# Altium schematic sheet Module.SchDoc
size A4
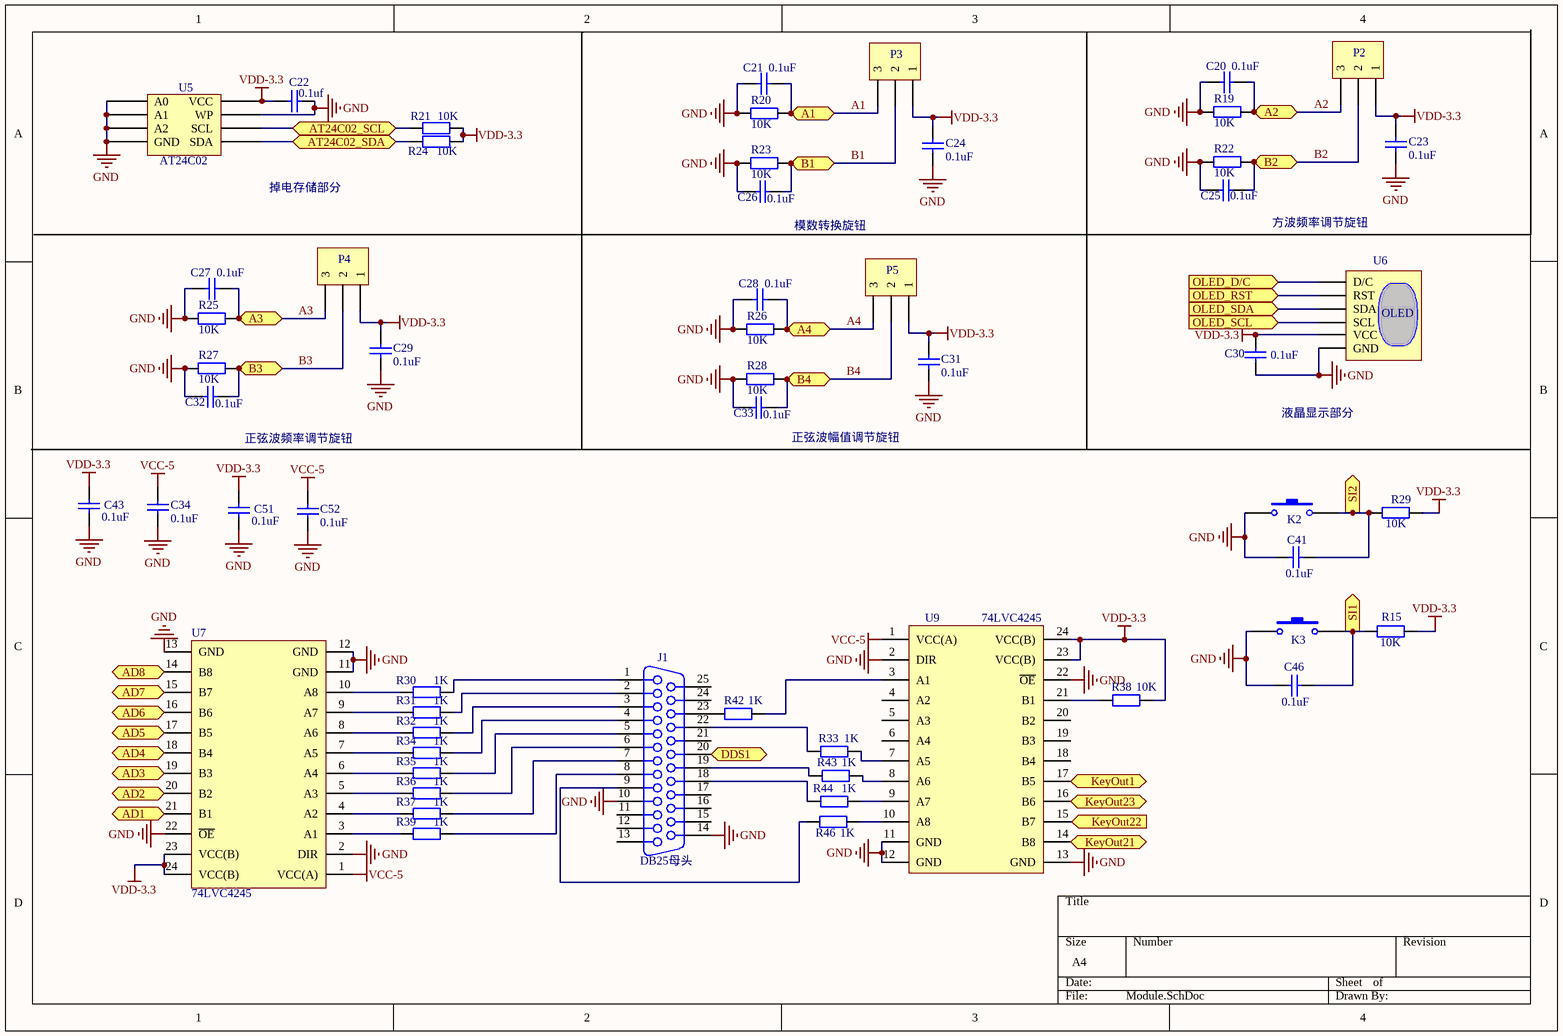
[diagram p0: Module.SchDoc]

## Parts
C20  value 0.1uF  [0603]  (hidden comment: Capacitor-0603)
C21  value 0.1uF  [0603]  (hidden comment: Capacitor-0603)
C22  value 0.1uf  [0603]  (hidden comment: Capacitor-0603)
C23  value 0.1uF  [0603]  (hidden comment: Capacitor-0603)
C24  value 0.1uF  [0603]  (hidden comment: Capacitor-0603)
C25  value 0.1uF  [0603]  (hidden comment: Capacitor-0603)
C26  value 0.1uF  [0603]  (hidden comment: Capacitor-0603)
C27  value 0.1uF  [0603]  (hidden comment: Capacitor-0603)
C28  value 0.1uF  [0603]  (hidden comment: Capacitor-0603)
C29  value 0.1uF  [0603]  (hidden comment: Capacitor-0603)
C30  value 0.1uF  [0603]  (hidden comment: Capacitor-0805)
C31  value 0.1uF  [0603]  (hidden comment: Capacitor-0603)
C32  value 0.1uF  [0603]  (hidden comment: Capacitor-0603)
C33  value 0.1uF  [0603]  (hidden comment: Capacitor-0603)
C34  value 0.1uF  [0603]  (hidden comment: Capacitor-0603)
C41  value 0.1uF  [0603]  (hidden comment: Capacitor-0603)
C43  value 0.1uF  [0603]  (hidden comment: Capacitor-0603)
C46  value 0.1uF  [0603]  (hidden comment: Capacitor-0603)
C51  value 0.1uF  [0603]  (hidden comment: Capacitor-0603)
C52  value 0.1uF  [0603]  (hidden comment: Capacitor-0603)
J1  value DB25母头  [DB25母头]  (hidden comment: DB25)
K2  按键  [2MM接线端子]  (value not drawn)
K3  按键  [2MM接线端子]  (value not drawn)
P2  端子3  [3MM接线端子]  (value not drawn)
P3  端子3  [3MM接线端子]  (value not drawn)
P4  端子3  [3MM接线端子]  (value not drawn)
P5  端子3  [3MM接线端子]  (value not drawn)
R15  value 10K  [0603]  (hidden comment: Resistor-0603)
R19  value 10K  [0603]  (hidden comment: Resistor-0603)
R20  value 10K  [0603]  (hidden comment: Resistor-0603)
R21  value 10K  [0603]  (hidden comment: Resistor-0603)
R22  value 10K  [0603]  (hidden comment: Resistor-0603)
R23  value 10K  [0603]  (hidden comment: Resistor-0603)
R24  value 10K  [0603]  (hidden comment: Resistor-0603)
R25  value 10K  [0603]  (hidden comment: Resistor-0603)
R26  value 10K  [0603]  (hidden comment: Resistor-0603)
R27  value 10K  [0603]  (hidden comment: Resistor-0603)
R28  value 10K  [0603]  (hidden comment: Resistor-0603)
R29  value 10K  [0603]  (hidden comment: Resistor-0603)
R30  value 1K  [0603]  (hidden comment: Resistor-0603)
R31  value 1K  [0603]  (hidden comment: Resistor-0603)
R32  value 1K  [0603]  (hidden comment: Resistor-0603)
R33  value 1K  [0603]  (hidden comment: Resistor-0603)
R34  value 1K  [0603]  (hidden comment: Resistor-0603)
R35  value 1K  [0603]  (hidden comment: Resistor-0603)
R36  value 1K  [0603]  (hidden comment: Resistor-0603)
R37  value 1K  [0603]  (hidden comment: Resistor-0603)
R38  value 10K  [0603]  (hidden comment: Resistor-0603)
R39  value 1K  [0603]  (hidden comment: Resistor-0603)
R42  value 1K  [0603]  (hidden comment: Resistor-0603)
R43  value 1K  [0603]  (hidden comment: Resistor-0603)
R44  value 1K  [0603]  (hidden comment: Resistor-0603)
R46  value 1K  [0603]  (hidden comment: Resistor-0603)
U5  AT24C02  [AT24C02]
U6  OLED  [OLED]
U7  74LVC4245  [74LVC4245-PW]
U9  74LVC4245  [74LVC4245-PW]

## Ports
A1, A2, A3, A4, AD1 (in), AD2 (in), AD3 (in), AD4 (in), AD5 (in), AD6 (in), AD7 (in), AD8 (in), AT24C02_SCL, AT24C02_SDA, B1, B2, B3, B4, DDS1 (in), KeyOut1 (in), KeyOut21 (in), KeyOut22 (in), KeyOut23 (in), OLED_D/C (in), OLED_RST (in), OLED_SCL (in), OLED_SDA (in), SI1 (out), SI2 (out)

## Nets
GND: C20.1 C21.1 C22.1 C23.2 C24.2 C25.1 C26.1 C27.1 C28.1 C29.2 C30.1 C31.2 C32.1 C33.1 C34.2 C41.1 C43.2 C46.1 C51.2 C52.2 J1.10 J1.14 K2.1 K3.1 R19.1 R20.1 R22.1 R23.1 R25.1 R26.1 R27.1 R28.1 U5.1(A0) U5.2(A1) U5.3(A2) U5.4(GND) U5.7(WP) U6.1(GND) U7.2(DIR) U7.11(GND) U7.12(GND) U7.13(GND) U7.22(~{OE}) U9.2(DIR) U9.11(GND) U9.12(GND) U9.13(GND) U9.22(~{OE})
VCC-5: C34.1 C52.1 U7.1(VCC(A)) U9.1(VCC(A))
VDD-3.3: C22.2 C23.1 C24.1 C29.1 C30.2 C31.1 C43.1 C51.1 P2.1 P3.1 P4.1 P5.1 R15.1 R21.1 R24.1 R29.2 R38.2 U5.8(VCC) U6.2(VCC) U7.23(VCC(B)) U7.24(VCC(B)) U9.23(VCC(B)) U9.24(VCC(B))
A1: C21.2 P3.3 R20.2 ; port A1
A2: C20.2 P2.3 R19.2 ; port A2
A3: C27.2 P4.3 R25.2 ; port A3
A4: C28.2 P5.3 R26.2 ; port A4
AD1: U7.21(B1) ; port AD1
AD2: U7.20(B2) ; port AD2
AD3: U7.19(B3) ; port AD3
AD4: U7.18(B4) ; port AD4
AD5: U7.17(B5) ; port AD5
AD6: U7.16(B6) ; port AD6
AD7: U7.15(B7) ; port AD7
AD8: U7.14(B8) ; port AD8
AT24C02_SCL: R21.2 U5.6(SCL) ; port AT24C02_SCL
AT24C02_SDA: R24.2 U5.5(SDA) ; port AT24C02_SDA
B1: C26.2 P3.2 R23.2 ; port B1
B2: C25.2 P2.2 R22.2 ; port B2
B3: C32.2 P4.2 R27.2 ; port B3
B4: C33.2 P5.2 R28.2 ; port B4
DDS1: J1.20 ; port DDS1
KeyOut1: U9.17(B5) ; port KeyOut1
KeyOut21: U9.14(B8) ; port KeyOut21
KeyOut22: U9.15(B7) ; port KeyOut22
KeyOut23: U9.16(B6) ; port KeyOut23
OLED_D/C: U6.6(D/C) ; port OLED_D/C
OLED_RST: U6.5(RST) ; port OLED_RST
OLED_SCL: U6.3(SCL) ; port OLED_SCL
OLED_SDA: U6.4(SDA) ; port OLED_SDA
SI1: C46.2 K3.2 R15.2 ; port SI1
SI2: C41.2 K2.2 R29.1 ; port SI2
NetJ1_1: J1.1 R30.2
NetJ1_2: J1.2 R31.2
NetJ1_3: J1.3 R32.2
NetJ1_4: J1.4 R34.2
NetJ1_5: J1.5 R35.2
NetJ1_6: J1.6 R36.2
NetJ1_7: J1.7 R37.2
NetJ1_8: J1.8 R39.2
NetJ1_9: J1.9 R46.1
NetJ1_18: J1.18 R44.1
NetJ1_19: J1.19 R43.1
NetJ1_22: J1.22 R33.1
NetJ1_23: J1.23 R42.1
NetR30_1: R30.1 U7.10(A8)
NetR31_1: R31.1 U7.9(A7)
NetR32_1: R32.1 U7.8(A6)
NetR33_2: R33.2 U9.7(A5)
NetR34_1: R34.1 U7.7(A5)
NetR35_1: R35.1 U7.6(A4)
NetR36_1: R36.1 U7.5(A3)
NetR37_1: R37.1 U7.4(A2)
NetR38_1: R38.1 U9.21(B1)
NetR39_1: R39.1 U7.3(A1)
NetR42_2: R42.2 U9.3(A1)
NetR43_2: R43.2 U9.8(A6)
NetR44_2: R44.2 U9.9(A7)
NetR46_2: R46.2 U9.10(A8)

Not connected (* = marked no-connect by the designer): J1 11 12 13 15 16 17 21 24 25; U9 4(A2) 5(A3) 6(A4) 18(B4) 19(B3) 20(B2)

## Notes on the sheet
- 掉电存储部分
- 模数转换旋钮
- 方波频率调节旋钮
- 正弦波频率调节旋钮
- 正弦波幅值调节旋钮
- 液晶显示部分

## Library data of the parts
C30 = Capacitor-0
U6 = O: Name: OLED
U5 = AT24C02: Name: AT24C02
U7 U9 = 74LVC4245: Name: 74LVC4245